# Altium schematic sheet power_supply.SchDoc
size A4; Organization: UNSW Solar Racing Team; Address3: UNSW; Address4: Sydney NSW 2052; Address2: Electrical Engineering; Address1: Rm 109
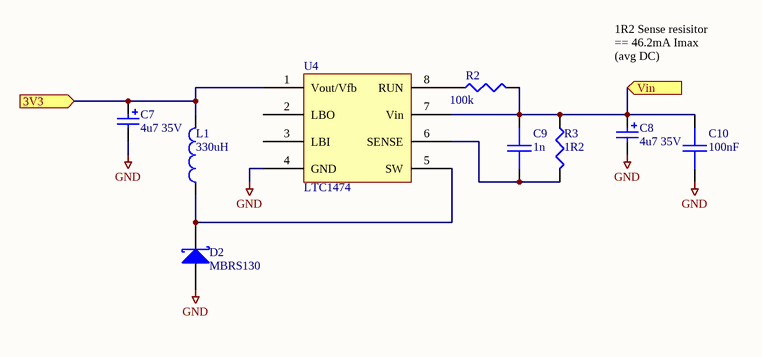
[diagram p0: power_supply.SchDoc]

## Parts
C7  4u7 35V  [MCCT-CASEC]
C8  4u7 35V  [MCCT-CASEC]
C9  1n  [0603]
C10  100nF  [0603]
D2  MBRS130  [SMB]
L1  330uH  [1812]
R2  100k  [0603]
R3  1R2  [0603]
U4  LTC1474  [SO8]

## Ports
3V3, Vin (in)

## Nets
GND: C7.2 C8.2 C10.2 D2.A U4.4(GND)
3V3: C7.1 L1.2 U4.1(Vout/Vfb) ; port 3V3
Vin: C8.1 C9.1 C10.1 R2.2 R3.1 U4.7(Vin) ; port Vin
NetC9_2: C9.2 R3.2 U4.6(SENSE)
NetD2_K: D2.K L1.1 U4.5(SW)
NetR2_1: R2.1 U4.8(RUN)

Not connected (* = marked no-connect by the designer): U4 2(LBO) 3(LBI)

## Notes on the sheet
- 1R2 Sense resisitor == 46.2mA Imax (avg DC)
- Title
- Size:
- Date:
- A4
- Number:
- Time:
- Revision:
- Sheet
- of
- File:

## Library data of the parts
C7 C8 = Cap Pol3: Polarized Capacitor (Surface Mount); Value: 4.7uF; Revision: July-2002: Re-released for DXP Platform.; Farnell: 967-294; Price: 1.97
C9 = CAP: Capacitor; Value: 1nF; Revision: July-2002: Re-released for DXP Platform.; Farnell: 317-202; Price: 0.15
C10 = CAP: Capacitor; Value: 0.1uF; Revision: July-2002: Re-released for DXP Platform.; Farnell: 753-567; Price: 0.31
D2 = D SCHOTTKY: Schottky Diode; Revision: July-2002: Re-released for DXP Platform.; Farnell: 708-150; Price: 1.49
L1 = Inductor: Revision: July-2002: Re-released for DXP Platform.; Value: 330uH; Farnell: 200-451; Price: 2.90
R2 = RES1: Resistor; Value: 100k; Farnell: 612-728; Price: 0.13
R3 = RES1: Resistor; Value: 1.2R; Revision: July-2002: Re-released for DXP Platform.; Farnell: 360-2229; Price: 0.15
U4 = LTC1474: Step-down converter; Farnell: NA